# EAGLE board DashCam Schematic (EAGLE 8.0.2)
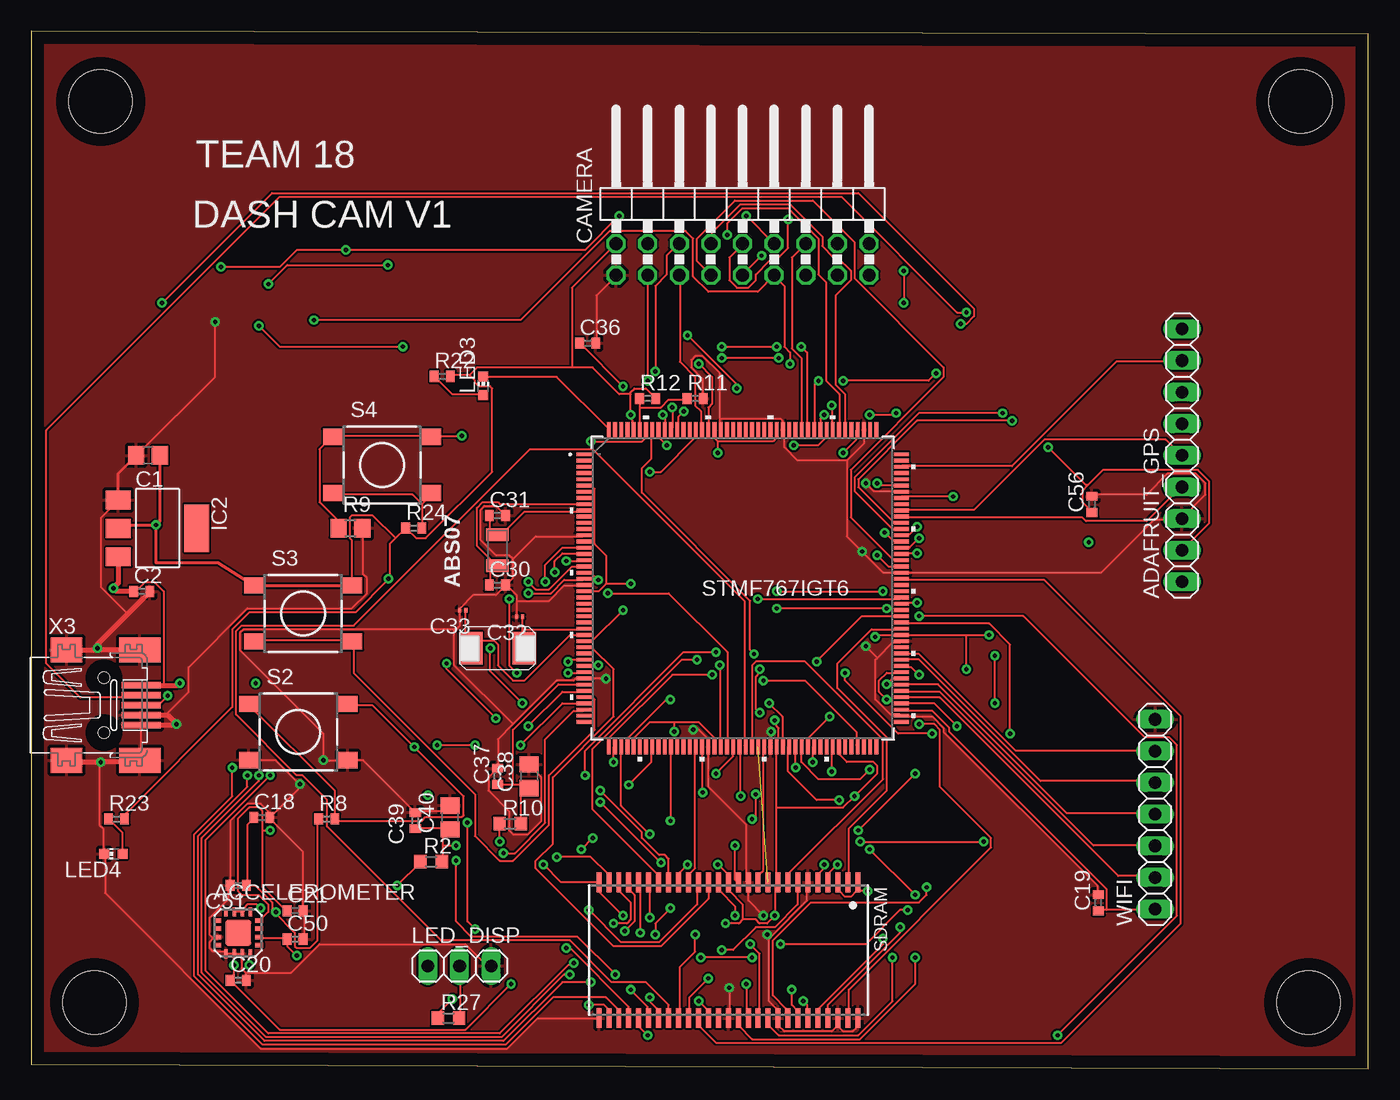
[diagram p2: board, top side]
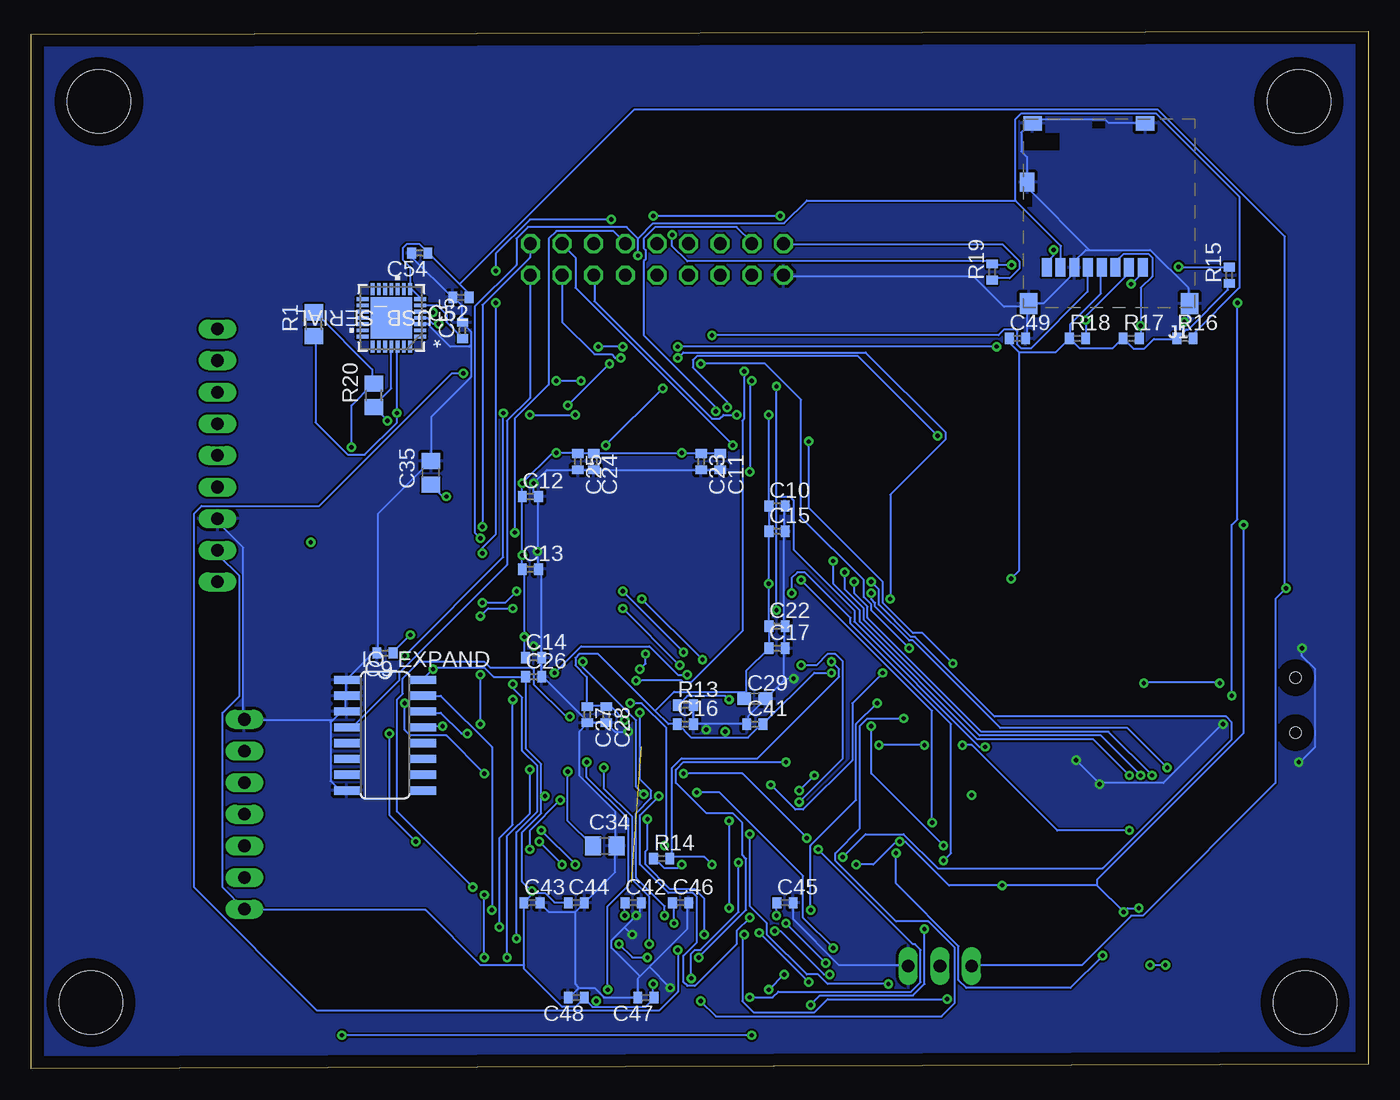
[diagram p3: board, bottom side, seen from below]

Size 107.42 x 83.36 mm. Coordinates in mm from the lower left corner, seen from the top.
Outline: 0,0.38 107.42,0 107.42,83.11 0,83.36 0,0.38
Copper layers (1*16): Top 0.035mm / dielectric 1.5mm / Bottom 0.035mm
Design rules "default": minimum track width 6mil, minimum drill 0.35mm, track to track 6mil, track to pad 6mil, pad to pad 6mil, via to via 6mil, smd to smd 6mil, copper to edge 40mil, drill to drill 6mil, minimum pad ring 10mil, minimum via ring 8mil, stop-mask expansion 4mil, vias tented up to drill 0mil, thermal gap 10mil
Holes 5.08 mm at 5.59,77.72 5.08,5.33 101.98,77.72 102.62,5.33

## Footprints (pad centres in the part's own frame; a part is rotated, then mirrored left to right if it is on the bottom)
6X3.3MM = smd 1.9 x 2.6: 1 -2.15,0; 2 2.15,0
2-SMD_ABM7 = smd 1 x 1.8: P$1 -1.25,0; P$2 1.25,0
LFCSP16 = smd 0.7 x 0.35: 1 -1.675,0.975; 2 -1.675,0.325; 3 -1.675,-0.325; 4 -1.675,-0.975; 9 1.675,-0.975; 10 1.675,-0.325; 11 1.675,0.325; 12 1.675,0.975 | smd 0.35 x 0.7: 5 -0.975,-1.675; 6 -0.325,-1.675; 7 0.325,-1.675; 8 0.975,-1.675; 13 0.975,1.675; 14 0.325,1.675; 15 -0.325,1.675; 16 -0.975,1.675 | smd 2.1 x 2.1: EXP 0,0
1X09 = drill 1.016 long: 1 -10.16,0; 2 -7.62,0; 3 -5.08,0; 4 -2.54,0; 5 0,0; 6 2.54,0; 7 5.08,0; 8 7.62,0; 9 10.16,0
C0805 = smd 1.3 x 1.5: 1 -0.95,0; 2 0.95,0
C0402 = smd 0.7 x 0.9: 1 -0.65,0; 2 0.65,0
C0603 = smd 1.1 x 1: 1 -0.85,0; 2 0.85,0
C0201 = smd 0.25 x 0.35: 1 -0.25,0; 2 0.25,0
2X09/90 = drill 1.016 octagon: 1 -10.16,-6.35; 2 -10.16,-3.81; 3 -7.62,-6.35; 4 -7.62,-3.81; 5 -5.08,-6.35; 6 -5.08,-3.81; 7 -2.54,-6.35; 8 -2.54,-3.81; 9 0,-6.35; 10 0,-3.81; 11 2.54,-6.35; 12 2.54,-3.81; 13 5.08,-6.35; 14 5.08,-3.81; 15 7.62,-6.35; 16 7.62,-3.81; 17 10.16,-6.35; 18 10.16,-3.81
SOT223 = smd 1.499 x 2.007: 1 -2.261,-3.15; 2 0.025,-3.15; 3 2.311,-3.15 | smd 3.81 x 2.007: 4 0,3.15
SO16 = smd 0.66 x 2.032: 1 -4.445,-3.073; 2 -3.175,-3.073; 3 -1.905,-3.073; 4 -0.635,-3.073; 5 0.635,-3.073; 6 1.905,-3.073; 7 3.175,-3.073; 8 4.445,-3.073; 9 4.445,3.073; 10 3.175,3.073; 11 1.905,3.073; 12 0.635,3.073; 13 -0.635,3.073; 14 -1.905,3.073; 15 -3.175,3.073; 16 -4.445,3.073
5025700893 = smd 1.4 x 1.7: GND0 6.45,7.1; GND2 -6.45,7.1 | smd 1.5 x 1.15: GND1 6.15,-7.375; GND3 -2.9,-7.375 | smd 1.15 x 1.5: GND4 6.575,-2.65 | smd 0.8 x 1.5: P$1 -2.7,4.2; P$2 -1.6,4.2; P$3 -0.5,4.2; P$4 0.6,4.2; P$5 1.7,4.2; P$6 2.8,4.2; P$7 3.9,4.2; P$8 5,4.2
CHIP-LED0603 = smd 0.8 x 0.8: A 0,-0.75; C 0,0.75
1X03 = drill 1.016 long: 1 -2.54,0; 2 0,0; 3 2.54,0
R0805 = smd 1.3 x 1.5: 1 -0.95,0; 2 0.95,0
R0603 = smd 1 x 1.1: 1 -0.85,0; 2 0.85,0
R0402 = smd 0.7 x 0.9: 1 -0.65,0; 2 0.65,0
DTSM-6 = smd 1.55 x 1.3: 1 -3.975,2.25; 2 3.975,2.25; 3 -3.975,-2.25; 4 3.975,-2.25
TSOP54 = smd 0.4 x 1.6: 1 -10.4,-5.45; 2 -9.6,-5.45; 3 -8.8,-5.45; 4 -8,-5.45; 5 -7.2,-5.45; 6 -6.4,-5.45; 7 -5.6,-5.45; 8 -4.8,-5.45; 9 -4,-5.45; 10 -3.2,-5.45; 11 -2.4,-5.45; 12 -1.6,-5.45; 13 -0.8,-5.45; 14 0,-5.45; 15 0.8,-5.45; 16 1.6,-5.45; 17 2.4,-5.45; 18 3.2,-5.45; 19 4,-5.45; 20 4.8,-5.45; 21 5.6,-5.45; 22 6.4,-5.45; 23 7.2,-5.45; 24 8,-5.45; 25 8.8,-5.45; 26 9.6,-5.45; 27 10.4,-5.45; 28 10.4,5.45; 29 9.6,5.45; 30 8.8,5.45; 31 8,5.45; 32 7.2,5.45; 33 6.4,5.45; 34 5.6,5.45; 35 4.8,5.45; 36 4,5.45; 37 3.2,5.45; 38 2.4,5.45; 39 1.6,5.45; 40 0.8,5.45; 41 0,5.45; 42 -0.8,5.45; 43 -1.6,5.45; 44 -2.4,5.45; 45 -3.2,5.45; 46 -4,5.45; 47 -4.8,5.45; 48 -5.6,5.45; 49 -6.4,5.45; 50 -7.2,5.45; 51 -8,5.45; 52 -8.8,5.45; 53 -9.6,5.45; 54 -10.4,5.45
LQFP-176_24X24 = smd 1.2 x 0.3: 1 -12.75,10.75; 2 -12.75,10.25; 3 -12.75,9.75; 4 -12.75,9.25; 5 -12.75,8.75; 6 -12.75,8.25; 7 -12.75,7.75; 8 -12.75,7.25; 9 -12.75,6.75; 10 -12.75,6.25; 11 -12.75,5.75; 12 -12.75,5.25; 13 -12.75,4.75; 14 -12.75,4.25; 15 -12.75,3.75; 16 -12.75,3.25; 17 -12.75,2.75; 18 -12.75,2.25; 19 -12.75,1.75; 20 -12.75,1.25; 21 -12.75,0.75; 22 -12.75,0.25; 23 -12.75,-0.25; 24 -12.75,-0.75; 25 -12.75,-1.25; 26 -12.75,-1.75; 27 -12.75,-2.25; 28 -12.75,-2.75; 29 -12.75,-3.25; 30 -12.75,-3.75; 31 -12.75,-4.25; 32 -12.75,-4.75; 33 -12.75,-5.25; 34 -12.75,-5.75; 35 -12.75,-6.25; 36 -12.75,-6.75; 37 -12.75,-7.25; 38 -12.75,-7.75; 39 -12.75,-8.25; 40 -12.75,-8.75; 41 -12.75,-9.25; 42 -12.75,-9.75; 43 -12.75,-10.25; 44 -12.75,-10.75; 89 12.75,-10.75; 90 12.75,-10.25; 91 12.75,-9.75; 92 12.75,-9.25; 93 12.75,-8.75; 94 12.75,-8.25; 95 12.75,-7.75; 96 12.75,-7.25; 97 12.75,-6.75; 98 12.75,-6.25; 99 12.75,-5.75; 100 12.75,-5.25; 101 12.75,-4.75; 102 12.75,-4.25; 103 12.75,-3.75; 104 12.75,-3.25; 105 12.75,-2.75; 106 12.75,-2.25; 107 12.75,-1.75; 108 12.75,-1.25; 109 12.75,-0.75; 110 12.75,-0.25; 111 12.75,0.25; 112 12.75,0.75; 113 12.75,1.25; 114 12.75,1.75; 115 12.75,2.25; 116 12.75,2.75; 117 12.75,3.25; 118 12.75,3.75; 119 12.75,4.25; 120 12.75,4.75; 121 12.75,5.25; 122 12.75,5.75; 123 12.75,6.25; 124 12.75,6.75; 125 12.75,7.25; 126 12.75,7.75; 127 12.75,8.25; 128 12.75,8.75; 129 12.75,9.25; 130 12.75,9.75; 131 12.75,10.25; 132 12.75,10.75 | smd 0.3 x 1.2: 45 -10.75,-12.75; 46 -10.25,-12.75; 47 -9.75,-12.75; 48 -9.25,-12.75; 49 -8.75,-12.75; 50 -8.25,-12.75; 51 -7.75,-12.75; 52 -7.25,-12.75; 53 -6.75,-12.75; 54 -6.25,-12.75; 55 -5.75,-12.75; 56 -5.25,-12.75; 57 -4.75,-12.75; 58 -4.25,-12.75; 59 -3.75,-12.75; 60 -3.25,-12.75; 61 -2.75,-12.75; 62 -2.25,-12.75; 63 -1.75,-12.75; 64 -1.25,-12.75; 65 -0.75,-12.75; 66 -0.25,-12.75; 67 0.25,-12.75; 68 0.75,-12.75; 69 1.25,-12.75; 70 1.75,-12.75; 71 2.25,-12.75; 72 2.75,-12.75; 73 3.25,-12.75; 74 3.75,-12.75; 75 4.25,-12.75; 76 4.75,-12.75; 77 5.25,-12.75; 78 5.75,-12.75; 79 6.25,-12.75; 80 6.75,-12.75; 81 7.25,-12.75; 82 7.75,-12.75; 83 8.25,-12.75; 84 8.75,-12.75; 85 9.25,-12.75; 86 9.75,-12.75; 87 10.25,-12.75; 88 10.75,-12.75; 133 10.75,12.75; 134 10.25,12.75; 135 9.75,12.75; 136 9.25,12.75; 137 8.75,12.75; 138 8.25,12.75; 139 7.75,12.75; 140 7.25,12.75; 141 6.75,12.75; 142 6.25,12.75; 143 5.75,12.75; 144 5.25,12.75; 145 4.75,12.75; 146 4.25,12.75; 147 3.75,12.75; 148 3.25,12.75; 149 2.75,12.75; 150 2.25,12.75; 151 1.75,12.75; 152 1.25,12.75; 153 0.75,12.75; 154 0.25,12.75; 155 -0.25,12.75; 156 -0.75,12.75; 157 -1.25,12.75; 158 -1.75,12.75; 159 -2.25,12.75; 160 -2.75,12.75; 161 -3.25,12.75; 162 -3.75,12.75; 163 -4.25,12.75; 164 -4.75,12.75; 165 -5.25,12.75; 166 -5.75,12.75; 167 -6.25,12.75; 168 -6.75,12.75; 169 -7.25,12.75; 170 -7.75,12.75; 171 -8.25,12.75; 172 -8.75,12.75; 173 -9.25,12.75; 174 -9.75,12.75; 175 -10.25,12.75; 176 -10.75,12.75
QFN28N5X5-0P5P = smd 0.965 x 0.305: 1 -2.324,1.5; 2 -2.324,1; 3 -2.324,0.5; 4 -2.324,0; 5 -2.324,-0.5; 6 -2.324,-1; 7 -2.324,-1.5; 15 2.324,-1.5; 16 2.324,-1; 17 2.324,-0.5; 18 2.324,0; 19 2.324,0.5; 20 2.324,1; 21 2.324,1.5 | smd 0.305 x 0.965: 8 -1.5,-2.324; 9 -1,-2.324; 10 -0.5,-2.324; 11 0,-2.324; 12 0.5,-2.324; 13 1,-2.324; 14 1.5,-2.324; 22 1.5,2.324; 23 1,2.324; 24 0.5,2.324; 25 0,2.324; 26 -0.5,2.324; 27 -1,2.324; 28 -1.5,2.324 | smd 3.353 x 3.353: 29 0,0
1X07 = drill 1.016 long: 1 -7.62,0; 2 -5.08,0; 3 -2.54,0; 4 0,0; 5 2.54,0; 6 5.08,0; 7 7.62,0
32005-201 = smd 3.1 x 0.5: 1 3,1.6; 2 3,0.8; 3 3,0; 4 3,-0.8; 5 3,-1.6 | smd 2.5 x 2: M1 -3,-4.45; M2 -3,4.45 | smd 3.3 x 2: M3 2.9,4.45; M4 2.9,-4.45 | hole 0.9: 0,2.2; 0,-2.2

## Placement (x,y rotation side)
ABM3  CRYSTAL25MHZ  [6X3.3MM]  37.47,33.78 180 top
ABS07  CRYSTAL32KHZ  [2-SMD_ABM7]  37.47,41.66 90 top
ACCELEROMETER  ADXL335  [LFCSP16]  16.64,10.92 0 top
ADAFRUIT_GPS  746  [1X09]  92.46,49.28 90 top
C1  10uF  [C0805]  9.4,49.28 180 top
C2  0.1uF  [C0402]  8.89,38.35 0 top
C9  0.1uF  [C0402]  78.99,33.4 180 bottom
C10  0.1uF  [C0402]  47.5,45.21 0 bottom
C11  0.1uF  [C0402]  52.07,48.77 270 bottom
C12  0.1uF  [C0402]  67.31,45.97 0 bottom
C13  0.1uF  [C0402]  67.31,40.13 0 bottom
C14  0.1uF  [C0402]  67.06,33.02 0 bottom
C15  0.1uF  [C0402]  47.5,43.18 0 bottom
C16  0.1uF  [C0402]  54.86,27.69 0 bottom
C17  0.1uF  [C0402]  47.5,33.78 0 bottom
C18  0.1uF  [C0402]  18.54,20.19 0 top
C19  0.1uF  [C0402]  85.72,13.33 90 top
C20  0.1uF  [C0402]  16.64,7.11 0 top
C21  0.1uF  [C0402]  21.21,12.7 0 top
C22  0.1uF  [C0402]  47.5,35.56 0 bottom
C23  0.1uF  [C0402]  53.59,48.77 270 bottom
C24  0.1uF  [C0402]  62.23,48.77 270 bottom
C25  0.1uF  [C0402]  63.5,48.77 270 bottom
C26  0.1uF  [C0402]  67.06,31.5 0 bottom
C27  0.1uF  [C0402]  62.74,28.45 270 bottom
C28  0.1uF  [C0402]  61.21,28.45 270 bottom
C29  4.7uF  [C0603]  49.28,29.72 0 bottom
C30  6pF  [C0402]  37.47,38.86 0 top
C31  6pF  [C0402]  37.47,44.45 0 top
C32  22pF  [C0201]  39.24,36.32 180 top
C33  22pF  [C0201]  34.67,36.83 180 top
C34  2.2uF  [C0805]  61.34,17.91 0 bottom
C35  2.2uF  [C0805]  75.31,47.88 90 bottom
C36  0.1uF  [C0402]  44.7,58.29 0 top
C37  0.1uF  [C0402]  37.47,23.5 90 top
C38  2.2uF  [C0805]  40.01,23.5 90 top
C39  0.1uF  [C0402]  30.86,19.94 90 top
C40  2.2uF  [C0805]  33.66,20.19 90 top
C41  0.1uF  [C0402]  49.28,27.69 0 bottom
C42  0.1uF  [C0402]  59.05,13.33 0 bottom
C43  0.1uF  [C0402]  67.18,13.33 0 bottom
C44  0.1uF  [C0402]  63.63,13.33 0 bottom
C45  0.1uF  [C0402]  46.86,13.33 0 bottom
C46  0.1uF  [C0402]  55.24,13.33 0 bottom
C47  0.1uF  [C0402]  58.04,5.71 180 bottom
C48  0.1uF  [C0402]  63.63,5.71 180 bottom
C49  0.1uF  [C0402]  28.19,58.67 0 bottom
C50  0.1uF  [C0402]  21.21,10.41 0 top
C51  0.1uF  [C0402]  16.64,14.73 180 top
C52  0.1uF  [C0402]  72.9,61.98 180 bottom
C54  1.0uF  [C0402]  76.2,65.53 180 bottom
C55  0.1uF  [C0402]  72.77,59.31 90 bottom
C56  0.1uF  [C0402]  85.22,45.34 90 top
CAMERA  OV2640  [2X09/90]  57.15,70.1 0 top
IC2  REG1117  [SOT223]  10.16,43.43 270 top
IO_EXPAND  PCF8574AT  [SO16]  78.99,26.8 270 bottom
J1  MICROSD_MOLEX_5025700893  [5025700893]  20.83,68.58 180 bottom
LED3  [CHIP-LED0603]  36.32,54.86 0 top
LED4  [CHIP-LED0603]  6.6,17.27 90 top
LED_DISP  NEOPIXEL  [1X03]  34.42,8.25 0 top
R1  100K  [R0805]  84.71,59.82 90 bottom
R2  10R  [R0603]  32.13,16.64 0 top
R8  10K  [R0402]  23.75,20.07 0 top
R9  100K  [R0805]  25.65,43.43 0 top
R10  10R  [R0603]  38.48,19.69 0 top
R11  0R  [R0402]  53.34,53.85 0 top
R12  0R  [R0402]  49.53,53.85 0 top
R13  10K  [R0402]  54.86,29.21 0 bottom
R14  10K  [R0402]  56.77,16.89 0 bottom
R15  47K  [R0402]  11.18,63.75 90 bottom
R16  47K  [R0402]  14.73,58.67 0 bottom
R17  47K  [R0402]  19.05,58.67 0 bottom
R18  47K  [R0402]  23.37,58.67 0 bottom
R19  47K  [R0402]  30.23,64.01 90 bottom
R20  100K  [R0805]  79.88,54.1 90 bottom
R22  100R  [R0402]  33.02,55.63 0 top
R23  100R  [R0402]  6.86,20.07 0 top
R24  47K  [R0402]  30.73,43.43 0 top
R27  470R  [R0603]  33.53,4.06 0 top
S2  DTSM-6  [DTSM-6]  21.46,27.05 0 top
S3  DTSM-6  [DTSM-6]  21.84,36.58 0 top
S4  DTSM-6  [DTSM-6]  28.19,48.51 0 top
SDRAM  W9825G6KH  [TSOP54]  56.01,9.53 180 top
STMF767IGT6  STM32F76XIXT  [LQFP-176_24X24]  57.15,38.61 0 top
USB_SERIAL  CP2102  [QFN28N5X5-0P5P]  78.49,60.32 180 bottom
WIFI  ESP8266  [1X07]  90.3,20.45 90 top
X3  MINI-USB-SCHIELD-32005-201  [32005-201]  5.84,29.21 0 top

## Tracks (layer width: path | path; a pad name or v marks a point on that pad's centre or on a via)
5V  (via drill 0.35)
  Top 0.152: 10.67,30.81 10.67,38.35 9.91,39.12 9.14,39.12 8.38,38.35 C2.1
  Top 0.406: X3.1 10.67,30.81 11.76,30.81 v11.94,30.99 | IC2.3 7.01,39.01 v6.6,38.61 6.86,38.35 C2.1
  Bottom 0.152: 76.96,62.74 76.2,61.98 USB_SERIAL.7 | 73,63.04 75.44,65.48 C54.1 75.59,65.63 76.2,66.24 77.27,66.24 77.57,65.94 77.57,65.02 76.96,64.41 76.96,62.74 | 73,63.04 72.39,62.43 72.39,61.98 C52.1 | 76.96,62.74 USB_SERIAL.8 | v18.03,30.99 17.98,31.04 12.04,31.04 v11.94,30.99 | LED_DISP.1 31.85,8.33 23.01,8.33 19.05,12.29 18.14,12.29 7.47,22.96 7.47,37.74 v6.6,38.61 6.71,38.66 6.71,66.85 16.92,77.06 58.98,77.06 73,63.04
ADC1_IN1  (via drill 0.35)
  Top 0.152: 18.59,19.15 18.59,14.58 20.42,12.75 C21.1 | 18.59,19.15 18.59,20.68 18.29,20.98 17.53,20.98 16.61,20.07 16.61,14.28 16.92,13.97 18.29,13.97 19.05,13.21 19.05,12.6 18.44,11.99 ACCELEROMETER.12 | v39.32,26.01 42.67,29.36 44.35,29.36 STMF767IGT6.41 | v32.61,26.01 v35.66,26.01 | 18.59,19.15 v19.2,19.15
  Bottom 0.152: v35.66,26.01 v39.32,26.01 | v32.61,26.01 31.85,26.01 24.99,19.15 v19.2,19.15
ADC1_IN2  (via drill 0.35)
  Top 0.152: ACCELEROMETER.10 18.44,10.46 20.42,10.46 C50.1 20.57,10.31 20.57,9.86 v21.34,9.09 | v37.95,17.32 38.86,17.32 41.3,19.76 41.3,26.47 43.59,28.75 44.35,28.75 STMF767IGT6.42
  Bottom 0.152: v37.95,17.32 37.95,14.88 32.92,9.86 32.92,7.11 32.31,6.5 23.93,6.5 v21.34,9.09
ADC1_IN3  (via drill 0.35)
  Top 0.152: v17.53,8.33 17.53,9.25 ACCELEROMETER.8 | v16.31,8.33 16.31,7.42 16,7.11 | v49.68,18.85 47.4,21.13 STMF767IGT6.47 | v38.56,6.81 34.9,3.15 19.96,3.15 16,7.11 | 16,7.11 C20.1
  Bottom 0.152: v16.31,8.33 v17.53,8.33 | v49.68,18.85 49.68,13.06 48.31,11.68 48.31,10.77 45.11,7.57 44.2,7.57 43.43,6.81 v38.56,6.81
D+  (via drill 0.35)
  Top 0.152: v74.68,59.84 75.13,59.84 75.74,60.45 75.74,61.06 66.45,70.36 19.36,70.36 v10.52,61.52 | v10.97,29.97 10.21,29.21 X3.3
  Bottom 0.152: v74.68,59.84 75.13,59.84 75.59,60.3 76.05,60.3 USB_SERIAL.4 | v10.52,61.52 10.52,44.14 10.97,43.69 v10.97,29.97
D-  (via drill 0.35)
  Top 0.152: v75.13,60.76 74.37,60.76 65.08,70.05 19.96,70.05 1.22,51.31 1.22,32.56 3.96,29.82 8.69,29.82 8.84,29.97 X3.2
  Bottom 0.152: v75.13,60.76 76.05,60.76 USB_SERIAL.5
DCMI_D0
  Top 0.152: CAMERA.7 53.49,64.87 53.49,66.7 56.54,69.75 62.79,69.75 66.14,66.4 66.14,63.5 73.3,56.34 73.3,55.57 65.84,48.11 65.84,44.3 69.19,40.95 69.8,40.95 STMF767IGT6.115
DCMI_D1  (via drill 0.35)
  Top 0.152: v71.17,41.4 69.95,41.4 STMF767IGT6.116 | v70.1,64.11 v70.1,61.52 | v60.81,68.22 60.81,65.94 59.74,64.87 59.28,64.87 58.22,63.8 58.22,63.35 57.61,62.74 56.69,62.74 56.08,63.35 56.08,65.18 57.15,66.24 CAMERA.10
  Bottom 0.152: v71.17,41.4 71.17,41.86 70.1,42.93 v70.1,61.52 | v70.1,64.11 70.1,65.48 67.36,68.22 v60.81,68.22
DCMI_D5
  Top 0.152: CAMERA.14 61.11,65.18 61.11,57.86 61.87,57.1 61.87,51.46 STMF767IGT6.145
DCMI_D6  (via drill 0.35)
  Top 0.152: v50.75,52.53 50.9,52.38 50.9,51.46 STMF767IGT6.167
  Bottom 0.152: v50.75,52.53 51.82,52.53 52.12,52.22 52.73,52.22 62.18,61.67 62.18,63.65 CAMERA.13
DCMI_D7  (via drill 0.35)
  Top 0.152: v51.05,50.09 50.44,50.7 50.44,51.31 STMF767IGT6.168
  Bottom 0.152: v51.05,50.09 63.7,62.74 63.7,65.18 64.77,66.24 CAMERA.16
DCMI_HREF  (via drill 0.35)
  Top 0.152: v58.83,31.19 62.18,31.19 66.29,27.08 66.29,26.01 STMF767IGT6.85 | v50.14,56.03 50.14,62.89 51.05,63.8 51.05,65.33 51.97,66.24 CAMERA.6
  Bottom 0.152: v58.83,31.19 55.17,31.19 55.02,31.04 54.41,31.04 50.29,35.15 50.29,52.07 50.14,52.22 v50.14,56.03
DCMI_PCLK  (via drill 0.35)
  Top 0.152: v48.01,22.81 49.84,24.64 49.84,25.86 STMF767IGT6.52 | v39.01,31.8 38.41,32.41 v38.41,37.74 | v60.05,57.1 v55.47,57.1
  Bottom 0.152: v48.01,22.81 46.02,20.83 45.41,20.83 41.45,24.79 41.45,29.36 v39.01,31.8 | v38.41,37.74 38.41,46.13 33.98,50.55 33.98,51.16 40.39,57.56 55.02,57.56 v55.47,57.1 | v60.05,57.1 60.5,57.1 60.81,57.4 62.18,57.4 64.77,59.99 CAMERA.15
DCMI_PWDN
  Bottom 0.152: IO_EXPAND.4 81.99,27.53 81.53,27.53 77.88,31.19 77.88,31.8 69.19,40.49 69.19,52.07 67.36,53.9 67.36,63.65 CAMERA.17
DCMI_RESET
  Top 0.152: STMF767IGT6.138 65.38,51.46 65.38,54.2 64.62,54.97 64.62,62.13 65.84,63.35 65.84,64.11 64.77,65.18 64.47,65.18 63.55,66.09 63.55,66.85 60.96,69.44 57,69.44 54.71,67.16 54.71,66.4 CAMERA.8
DCMI_SCL  (via drill 0.35)
  Top 0.152: v49.68,47.95 50.6,47.95 53.34,50.7 53.34,51.31 STMF767IGT6.162 | CAMERA.3 v49.53,55.27
  Bottom 0.152: v49.68,47.95 49.68,55.12 v49.53,55.27
DCMI_SDA
  Top 0.152: STMF767IGT6.161 53.8,51.46 53.8,52.83 53.34,53.29 53.34,55.57 52.12,56.79 52.12,63.65 CAMERA.5
DCMI_VSYNC  (via drill 0.35)
  Top 0.152: v52.43,52.83 51.97,52.38 51.97,51.46 STMF767IGT6.165
  Bottom 0.152: v52.43,52.83 52.43,53.14 58.22,58.93 58.22,64.87 58.06,65.02 58.06,65.79 58.22,65.94 58.22,66.7 57.3,67.62 50.75,67.62 49.53,66.4 CAMERA.4
DCMI_XCLK  (via drill 0.35)
  Top 0.152: v71.17,43.54 70.56,42.93 69.95,42.93 STMF767IGT6.119
  Bottom 0.152: v71.17,43.54 71.17,61.37 67.36,65.18 67.36,66.24 CAMERA.18
FMC_A0  (via drill 0.35)
  Top 0.152: v41.3,39.12 41.3,40.49 42.67,41.86 44.35,41.86 STMF767IGT6.16 | v17.37,23.57 17.37,22.66 13.41,18.69 13.41,7.57 18.75,2.24 37.95,2.24 42.67,6.96 v44.96,6.96 | v48.92,10.92 48.92,14.88 SDRAM.23
  Bottom 0.152: v41.3,39.12 41.3,38.2 40.23,37.13 40.23,36.22 31.09,27.08 20.88,27.08 v17.37,23.57 | v48.92,10.92 v44.96,6.96
FMC_A1  (via drill 0.35)
  Top 0.152: v42.06,39.88 42.06,40.79 42.67,41.4 44.35,41.4 STMF767IGT6.17 | v18.29,23.57 18.29,23.11 13.72,18.54 13.72,7.72 18.9,2.54 37.8,2.54 42.82,7.57 v43.28,7.57 | v47.7,11.07 48.46,11.84 48.46,13.97 48.16,14.28 48.16,14.88 SDRAM.24
  Bottom 0.152: v42.06,39.88 42.06,38.51 40.54,36.98 40.54,36.07 31.24,26.77 21.49,26.77 v18.29,23.57 | v43.28,7.57 43.74,7.57 47.24,11.07 v47.7,11.07
FMC_A2  (via drill 0.35)
  Top 0.152: v42.98,40.79 44.35,40.79 STMF767IGT6.18 | v19.2,23.57 14.02,18.39 14.02,7.87 19.05,2.85 37.64,2.85 43.28,8.48 v43.59,8.48 | v46.79,11.68 47.85,11.68 48.16,11.99 48.16,13.36 47.24,14.28 47.24,14.88 SDRAM.25
  Bottom 0.152: v42.98,40.79 42.98,38.96 40.84,36.83 40.84,35.92 31.39,26.47 22.1,26.47 v19.2,23.57 | v46.79,11.68 v43.59,8.48
FMC_A3  (via drill 0.35)
  Top 0.152: v39.93,39.12 40.54,38.51 41.6,38.51 43.43,40.34 44.35,40.34 STMF767IGT6.19 | v42.22,17.02 44.96,17.02 46.33,15.65 46.33,15.04 SDRAM.26
  Bottom 0.152: v39.93,39.12 39.32,38.51 39.32,37.29 36.73,34.7 36.42,34.7 30.02,28.3 11.43,28.3 10.97,27.84 10.97,26.47 21.34,16.1 34.59,16.1 37.34,18.85 40.39,18.85 v42.22,17.02
FMC_A4  (via drill 0.35)
  Top 0.152: v45.57,39.27 44.96,39.88 44.5,39.88 STMF767IGT6.20 | v35.05,19.76 35.05,11.84 v35.66,11.23 | v44.81,5.13 46.02,5.13 46.33,4.83 46.33,4.22 SDRAM.29
  Bottom 0.152: v45.57,39.27 35.05,28.75 v35.05,19.76 | v35.66,11.23 35.66,6.81 36.58,5.89 44.04,5.89 v44.81,5.13
FMC_A5  (via drill 0.35)
  Top 0.152: v39.93,38.2 41.76,38.2 42.82,39.27 44.35,39.27 STMF767IGT6.21 | v16.15,24.18 16.15,21.89 13.11,18.85 13.11,7.42 18.59,1.93 38.1,1.93 41.91,5.74 46.18,5.74 47.09,4.83 47.09,4.22 SDRAM.30
  Bottom 0.152: v39.93,38.2 39.93,37.74 39.62,37.44 39.62,37.13 36.88,34.39 36.58,34.39 29.57,27.38 19.36,27.38 v16.15,24.18
FMC_A6  (via drill 0.35)
  Top 0.152: v53.95,22.2 53.95,25.86 STMF767IGT6.60 | v42.98,9.7 43.28,9.7 48.01,4.98 48.01,4.22 SDRAM.31
  Bottom 0.152: v53.95,22.2 52.12,22.2 45.41,15.49 45.41,12.14 v42.98,9.7
FMC_A7  (via drill 0.35)
  Top 0.152: v55.32,32.41 55.32,26.01 STMF767IGT6.63 | v68.73,36.98 v59.89,36.98 | v71.32,36.37 79.7,36.37 89.46,26.62 91.44,26.62 92.05,26.01 92.05,12.29 v82.45,2.69 | v49.53,2.69 48.92,3.3 48.92,4.06 SDRAM.32
  Bottom 0.152: v59.89,36.98 v55.32,32.41 | v68.73,36.98 70.71,36.98 v71.32,36.37 | v49.53,2.69 v82.45,2.69
FMC_A8  (via drill 0.35)
  Top 0.152: v46.33,38.2 51.21,38.2 55.93,33.48 55.93,26.01 STMF767IGT6.64 | v34.14,16.71 34.14,11.84 35.36,10.62 43.89,10.62 v46.94,7.57 | v48.16,6.35 49.53,4.98 49.53,4.22 SDRAM.33
  Bottom 0.152: v46.33,38.2 46.33,39.42 45.87,39.88 45.26,39.88 41.6,36.22 41.6,35.76 33.53,27.69 33.53,17.32 v34.14,16.71 | v48.16,6.35 v46.94,7.57
FMC_A9  (via drill 0.35)
  Top 0.152: v55.02,23.72 56.39,25.1 56.39,25.86 STMF767IGT6.65 | v44.2,17.63 v45.11,18.54 | v49.68,5.74 49.68,5.44 50.29,4.83 50.29,4.22 SDRAM.34
  Bottom 0.152: v55.02,23.72 50.29,23.72 v45.11,18.54 | v44.2,17.63 36.58,10.01 36.42,10.01 35.97,9.55 35.97,6.96 36.73,6.2 47.4,6.2 47.85,5.74 v49.68,5.74
FMC_A10  (via drill 0.35)
  Top 0.152: v57,21.89 57,25.86 STMF767IGT6.66 | v49.68,12.14 49.68,14.88 SDRAM.22
  Bottom 0.152: v57,21.89 58.52,20.37 58.52,16.41 56.24,14.12 54.25,14.12 53.95,13.82 53.95,10.16 55.02,9.09 55.02,6.96 54.71,6.65 54.1,6.65 50.75,10.01 50.75,11.07 v49.68,12.14
FMC_A11
  Top 0.152: STMF767IGT6.67 57.3,26.01 57.3,37.59 45.11,49.78 40.08,49.78 25.91,35.61 16.92,35.61 16.46,35.15 16.46,28.45 21.34,23.57 21.79,23.57 23.77,21.59 23.77,19.46 32.92,10.31 43.28,10.31 46.63,6.96 49.38,6.96 51.21,5.13 51.21,4.22 SDRAM.35
FMC_A12  (via drill 0.35)
  Top 0.152: v63.09,32.71 66.75,36.37 69.8,36.37 STMF767IGT6.106 | v58.22,22.05 58.22,20.37 v57.91,20.07 | v53.34,10.77 53.34,9.4 52.12,8.18 52.12,4.22 SDRAM.36
  Bottom 0.152: v63.09,32.71 63.09,32.26 58.83,27.99 58.83,22.66 v58.22,22.05 | v57.91,20.07 57.91,17.63 58.06,17.48 58.06,16.41 56.08,14.43 54.1,14.43 53.34,13.66 v53.34,10.77
FMC_BA0  (via drill 0.35)
  Top 0.152: v71.17,37.44 69.95,37.44 STMF767IGT6.108 | v59.89,38.35 v68.43,38.35 | v55.02,33.48 52.43,33.48 44.5,25.55 v44.5,23.57 | v45.72,22.35 49.07,19 49.07,18.54 50.44,17.17 50.9,17.17 51.21,16.87 51.21,15.04 SDRAM.20
  Bottom 0.152: v71.17,37.44 69.34,37.44 v68.43,38.35 | v55.02,33.48 v59.89,38.35 | v45.72,22.35 v44.5,23.57
FMC_BA1  (via drill 0.35)
  Top 0.152: v58.37,37.74 69.8,37.74 STMF767IGT6.109 | v53.49,32.87 52.27,32.87 45.11,25.71 45.11,20.83 50.29,15.65 50.29,15.04 SDRAM.21
  Bottom 0.152: v53.49,32.87 v58.37,37.74
FMC_D0
  Top 0.152: STMF767IGT6.104 69.8,35.31 67.51,35.31 64.77,32.56 64.77,30.58 68.73,26.62 68.73,22.35 65.68,19.3 65.68,15.04 SDRAM.2
FMC_D1  (via drill 0.35)
  Top 0.152: v78.64,26.92 78.64,34.09 76.96,35.76 69.95,35.76 STMF767IGT6.105 | v66.6,18.24 v76.5,18.24 | v64.77,16.41 64.01,15.65 64.01,15.04 SDRAM.4
  Bottom 0.152: v78.64,26.92 78.64,20.37 v76.5,18.24 | v64.77,16.41 v66.6,18.24
FMC_D2  (via drill 0.35)
  Top 0.152: v63.7,52.53 63.4,52.22 63.4,51.46 STMF767IGT6.142 | v67.36,52.53 69.34,52.53 v69.49,52.68 | v77.42,29.36 v77.42,33.17 | v66.45,19.15 v71.02,23.72 | v63.7,16.41 63.7,16.1 63.25,15.65 63.25,15.04 SDRAM.5
  Bottom 0.152: v67.36,52.53 v63.7,52.53 | v69.49,52.68 69.49,41.1 v77.42,33.17 | v77.42,29.36 77.42,27.23 76.96,26.77 74.07,26.77 v71.02,23.72 | v63.7,16.41 v66.45,19.15
FMC_D3  (via drill 0.35)
  Top 0.152: v63.25,55.27 62.94,54.97 62.94,51.46 STMF767IGT6.143 | v65.23,55.27 72.08,55.27 v72.69,55.88 | v55.47,9.55 56.39,9.55 58.22,11.38 59.74,11.38 61.57,13.21 61.57,14.88 SDRAM.7
  Bottom 0.152: v65.23,55.27 v63.25,55.27 | v72.69,55.88 73.61,55.88 84.28,45.21 93.73,45.21 94.34,44.6 94.34,14.58 84.43,4.67 57,4.67 55.47,6.2 v55.47,9.55
FMC_D4
  Top 0.152: STMF767IGT6.68 57.91,26.01 57.91,32.41 58.22,32.71 62.18,32.71 68.43,26.47 68.43,23.27 60.81,15.65 60.81,15.04 SDRAM.8
FMC_D5  (1 unrouted)
FMC_D6
  Top 0.152: STMF767IGT6.70 58.83,25.86 58.83,15.95 58.52,15.65 58.52,15.04 SDRAM.11
FMC_D7  (via drill 0.35)
  Top 0.152: v59.28,29.36 60.35,28.3 60.35,26.01 STMF767IGT6.73 | v56.54,17.93 56.54,15.19 56.69,15.04 SDRAM.13
  Bottom 0.152: v59.28,29.36 58.37,29.36 56.39,27.38 56.39,18.09 v56.54,17.93
FMC_D8  (via drill 0.35)
  Top 0.152: v64.92,21.59 63.09,21.59 60.81,23.88 60.81,25.86 STMF767IGT6.74 | v71.02,13.97 v67.36,17.63 | v71.02,8.94 71.02,6.81 66.6,2.39 57.91,2.39 56.84,3.45 56.84,4.06 SDRAM.42
  Bottom 0.152: v64.92,21.59 67.36,19.15 v67.36,17.63 | v71.02,8.94 v71.02,13.97
FMC_D9  (via drill 0.35)
  Top 0.152: v61.42,24.18 61.42,25.86 STMF767IGT6.75 | v57.76,10.01 58.52,9.25 58.52,4.22 SDRAM.44
  Bottom 0.152: v61.42,24.18 61.42,22.5 59.13,20.22 59.13,15.19 57.76,13.82 v57.76,10.01
FMC_D10  (via drill 0.35)
  Top 0.152: v67.36,24.03 66.6,23.27 63.25,23.27 61.87,24.64 61.87,25.86 STMF767IGT6.76 | v69.19,8.94 69.19,5.44 66.45,2.69 60.05,2.69 59.28,3.45 59.28,4.06 SDRAM.45
  Bottom 0.152: v67.36,24.03 67.36,20.52 69.19,18.69 v69.19,8.94
FMC_D11  (via drill 0.35)
  Top 0.152: v64.16,28.3 62.48,26.62 62.48,26.01 STMF767IGT6.77 | v71.93,14.58 71.93,13.97 71.32,13.36 62.64,13.36 59.59,10.31 59.59,5.89 60.66,4.83 60.66,4.22 SDRAM.47
  Bottom 0.152: v64.16,28.3 64.47,28.3 67.06,30.89 67.06,32.11 67.21,32.26 70.56,32.26 71.02,32.71 76.2,32.71 77.57,31.34 77.57,30.12 78.03,29.67 78.03,20.68 v71.93,14.58
FMC_D12  (via drill 0.35)
  Top 0.152: v62.79,24.64 62.79,25.86 STMF767IGT6.78 | v61.11,6.35 61.11,5.13 61.57,4.67 61.57,4.22 SDRAM.48
  Bottom 0.152: v62.79,24.64 62.79,23.42 59.44,20.07 59.44,14.73 61.11,13.06 v61.11,6.35
FMC_D13  (via drill 0.35)
  Top 0.152: v68.73,30.89 69.19,31.34 69.8,31.34 STMF767IGT6.96 | v68.43,10.46 68.43,10.01 63.25,4.83 63.25,4.22 SDRAM.50
  Bottom 0.152: v68.73,30.89 68.73,30.58 67.97,29.82 67.97,25.55 66.75,24.33 66.75,20.68 68.43,19 v68.43,10.46
FMC_D14  (via drill 0.35)
  Top 0.152: v68.73,29.67 68.12,30.28 68.12,31.19 68.73,31.8 69.8,31.8 STMF767IGT6.97 | v69.8,11.38 69.8,10.92 64.01,5.13 64.01,4.22 SDRAM.51
  Bottom 0.152: v68.73,29.67 68.73,19.61 69.8,18.54 v69.8,11.38
FMC_D15  (via drill 0.35)
  Top 0.152: v71.32,31.65 70.71,32.26 69.95,32.26 STMF767IGT6.98 | v71.32,27.69 72.54,27.69 73,27.23 73,22.66 77.11,18.54 77.11,17.78 65.68,6.35 65.68,4.22 SDRAM.53
  Bottom 0.152: v71.32,27.69 v71.32,31.65
FMC_NBL0  (via drill 0.35)
  Top 0.152: v58.06,33.32 57.76,33.63 57.76,37.59 49.07,46.28 49.07,48.26 49.84,49.02 49.84,51.31 STMF767IGT6.169 | v58.52,32.11 58.52,31.8 58.22,31.5 58.22,28.91 v58.52,28.6 | v56.54,12.29 56.54,13.06 55.32,14.28 55.32,14.88 SDRAM.15
  Bottom 0.152: v58.06,33.32 58.06,32.56 v58.52,32.11 | v58.52,28.6 58.52,23.27 57.61,22.35 57.61,21.74 58.83,20.52 58.83,15.34 56.54,13.06 v56.54,12.29
FMC_NBL1  (via drill 0.35)
  Top 0.152: v44.96,50.39 49.07,50.39 49.38,50.7 49.38,51.31 STMF767IGT6.170 | v33.38,32.56 33.38,32.11 v37.34,28.14 | v53.65,5.44 54.41,4.67 54.41,4.22 SDRAM.39
  Bottom 0.152: v44.96,50.39 44.96,45.06 39.01,39.12 39.01,37.44 36.58,35 35.81,35 v33.38,32.56 | v37.34,28.14 40.23,28.14 40.84,27.53 40.84,19.3 42.82,17.32 42.82,16.71 37.95,11.84 35.36,11.84 33.22,9.7 33.22,5.28 34.29,4.22 52.43,4.22 v53.65,5.44
FMC_SDCKE0  (via drill 0.35)
  Top 0.152: v45.57,32.41 44.5,32.41 STMF767IGT6.35 | v50.6,16.56 v45.72,21.44 | v54.41,7.26 52.88,5.74 52.88,4.22 SDRAM.37
  Bottom 0.152: v45.57,32.41 44.35,32.41 43.43,33.32 42.82,33.32 42.22,32.71 42.22,24.94 v45.72,21.44 | v50.6,16.56 50.6,12.6 53.65,9.55 54.1,9.55 54.41,9.25 v54.41,7.26
FMC_SDCLK
  Top 0.152: STMF767IGT6.112 69.95,39.27 81.38,39.27 92.35,28.3 92.35,11.68 82.75,2.08 55.02,2.08 53.65,3.45 53.65,4.06 SDRAM.38
FMC_SDNCAS  (via drill 0.35)
  Top 0.152: v53.65,56.64 54.71,55.57 54.71,53.44 54.41,53.14 54.41,51.46 STMF767IGT6.160 | v36.88,33.78 36.88,31.95 v39.47,29.36 | v44.81,12.75 47.4,10.16 50.44,10.16 53.49,13.21 53.49,14.88 SDRAM.17
  Bottom 0.152: v53.65,56.64 48.46,56.64 45.57,53.75 45.57,44.3 40.54,39.27 40.54,37.9 39.93,37.29 39.93,36.83 v36.88,33.78 | v39.47,29.36 41.15,27.69 41.15,21.59 44.81,17.93 v44.81,12.75
FMC_SDNE0  (via drill 0.35)
  Top 0.152: v52.73,16.41 52.12,15.8 52.12,15.04 SDRAM.19 | v43.13,32.71 43.28,32.87 44.35,32.87 STMF767IGT6.34
  Bottom 0.152: 55.93,17.02 53.34,17.02 v52.73,16.41 | 55.93,17.02 56.08,17.02 R14.2 55.93,17.02 | v43.13,32.71 42.52,32.11 42.52,31.5 49.07,24.94 55.17,24.94 55.93,24.18 55.93,17.02
FMC_SDNRAS
  Top 0.152: STMF767IGT6.59 53.34,25.86 53.34,16.1 52.88,15.65 52.88,15.04 SDRAM.18
FMC_SDNWE
  Top 0.152: STMF767IGT6.32 44.5,33.78 45.11,33.78 46.79,32.11 46.79,28.3 41.91,23.42 41.91,18.09 40.54,16.71 40.54,16.1 46.79,9.86 50.6,9.86 54.41,13.66 54.41,14.88 SDRAM.16
GND  (via drill 0.35)
  Top 0.152: C36.2 45.41,58.32 45.41,62.13 46.94,63.65 CAMERA.1 | C40.2 33.53,21.13 33.07,20.68 30.94,20.68 C39.2 30.79,20.68 26.67,24.79 25.45,24.79 S2.4 25.3,24.79 v23.47,24.79 23.47,26.92 16.76,33.63 16.76,35 17.07,35.31 34.14,35.31 | 14.63,10.46 14.94,10.46 ACCELEROMETER.3 14.63,10.46 | 14.63,10.46 14.33,10.16 14.33,9.7 14.63,9.4 15.54,9.4 ACCELEROMETER.5 15.7,9.25 ACCELEROMETER.6 16.46,9.25 16.92,9.25 | 17.22,7.72 17.22,7.11 C20.2 | 17.22,7.72 16.92,8.03 16.92,9.25 | 16.92,9.25 ACCELEROMETER.7 | 14.63,10.46 14.33,10.77 14.33,12.14 15.85,13.66 15.85,14.73 C51.2 16,14.73 16,19.91 17.37,21.29 18.44,21.29 19.36,20.37 | C50.2 21.95,10.46 21.95,12.6 C21.2 21.79,12.75 21.79,17.48 19.2,20.07 C18.2 | 19.36,20.37 19.2,20.22 C18.2 | 19.36,20.37 21.49,22.5 21.49,22.81 v21.59,22.86 19.66,24.79 17.53,24.79 S2.3 | 19.36,20.37 C18.2 | 17.22,7.72 20.88,7.72 23.16,10.01 34.9,10.01 36.58,8.33 36.88,8.33 LED_DISP.3 | R9.2 26.67,43.38 26.67,39.73 26.98,39.42 26.98,38.2 25.76,36.98 17.37,36.98 12.65,32.26 12.65,30.28 10.97,28.6 10.96,28.41 | 7.74,36.55 5.64,38.66 5.64,44.3 7.01,45.67 IC2.1 | v5.59,24.64 5.49,24.49 5.49,19.61 5.79,19.3 5.79,17.32 LED4.C 5.94,17.17 5.94,14.12 18.44,1.63 38.25,1.63 40.69,4.06 45.57,4.06 SDRAM.28 | X3.5 8.84,27.53 8.84,24.94 X3.M4 | v14.78,59.99 14.78,55.57 8.53,49.33 C1.2 | C56.2 85.34,46.13 89.61,46.13 91.29,47.8 93.57,47.8 94.34,47.04 94.34,46.13 92.51,44.3 ADAFRUIT_GPS.3 92.35,44.14 90.22,44.14 85.95,39.88 69.95,39.88 STMF767IGT6.113 69.8,39.88 68.43,39.88 v66.75,41.55 65.53,42.77 65.53,48.87 | 34.44,36.83 34.44,36.98 35.51,38.05 37.34,38.05 38.1,38.81 C30.2
  Top 0.152: 39.01,37.59 39.01,38.05 38.25,38.81 C30.2 | 39.01,37.59 39.01,36.37 C32.2 | 38.71,40.95 38.41,41.25 37.34,41.25 36.12,42.47 36.12,44.91 36.42,45.21 37.34,45.21 38.1,44.45 C31.2 | 38.71,40.95 38.71,39.42 38.25,38.96 C30.2 | 39.01,37.59 41.6,37.59 42.82,38.81 44.35,38.81 STMF767IGT6.22 | 38.71,40.95 40.54,42.77 44.35,42.77 STMF767IGT6.14 | 38.71,27.69 42.22,31.19 43.59,31.19 43.74,31.34 44.35,31.34 STMF767IGT6.37 44.5,31.34 v46.18,31.34 | 38.71,27.69 37.49,26.47 37.49,24.18 C37.2 37.34,24.03 36.73,23.42 36.73,22.35 38.41,20.68 38.41,19.15 38.71,18.85 39.93,18.85 41,19.91 41,23.42 40.08,24.33 C38.2 | 34.44,36.83 34.44,35.61 34.14,35.31 | 34.14,35.31 33.98,35.15 33.98,32.41 38.71,27.69 | 34.44,36.83 C33.2 | v53.19,27.23 53.65,27.23 54.41,26.47 54.41,26.01 STMF767IGT6.61 54.41,22.66 57.45,19.61 57.45,15.04 SDRAM.12 57.61,14.88 57.61,13.51 v58.83,12.29 | C19.2 85.65,14.12 85.65,14.73 73.3,27.08 73.3,27.38 72.39,28.3 69.95,28.3 STMF767IGT6.90 69.8,28.45 69.04,28.45 67.82,29.67 67.82,32.87 67.97,33.02 | 67.97,33.02 69.19,34.24 69.8,34.24 STMF767IGT6.102 | 55.32,52.22 55.32,51.46 STMF767IGT6.158 | 55.32,52.22 55.32,55.88 53.95,57.25 53.34,57.25 53.03,56.95 53.03,56.34 53.95,55.42 53.95,53.9 R11.2 | 55.32,52.22 60.2,52.22 60.35,52.07 60.35,51.46 STMF767IGT6.148 60.5,51.31 60.5,49.94 61.57,48.87 65.53,48.87 | 65.53,48.87 66.9,50.24 66.9,51.31 STMF767IGT6.135 | 64.77,3.45 64.31,3 60.5,3 60.05,3.45 60.05,4.06 SDRAM.46 59.89,4.22 59.89,4.83 59.28,5.44 59.28,10.46 59.44,10.62 | 64.77,3.45 64.77,4.06 SDRAM.52 64.77,3.45 | 59.44,10.62 62.33,13.51 62.33,14.88 SDRAM.6
  Top 0.152: 64.77,3.45 65.23,3 65.99,3 66.29,3.3 66.29,4.06 SDRAM.54 | v56.08,6.5 56.08,4.22 SDRAM.41 | 59.44,10.62 59.28,10.62 v59.13,10.77 | v59.44,27.08 59.44,26.01 STMF767IGT6.71 | v67.06,47.04 67.67,46.43 69.8,46.43 STMF767IGT6.126 | v67.06,33.93 67.97,33.02
  Top 0.254: IC2.1 7.01,47.84 C1.2
  Top 0.406: X3.M1 2.96,24.64 v5.59,24.64 8.62,24.64 X3.M4 | X3.M2 5.21,33.66 | 5.21,33.66 v5.33,33.78 5.33,34.14 7.74,36.55 8.95,37.76 C2.2 | X3.M3 5.21,33.66 | X3.4 10.96,28.41 v11.68,27.69 11.61,27.61 X3.5
  Bottom 0.152: J1.GND3 17.98,76 20.88,76 21.18,76.3 26.67,76.3 26.98,76 J1.GND1 27.13,76 27.89,75.23 27.89,73.71 27.43,73.25 27.43,71.27 J1.GND4 27.28,71.12 27.28,70.66 22.4,65.79 | 27.43,61.21 27.43,58.78 C49.2 | 27.43,61.21 27.28,61.37 J1.GND0 | J1.GND0 27.13,61.52 26.06,61.52 23.77,63.8 23.77,64.26 J1.P$6 23.62,64.41 23.62,64.87 22.71,65.79 22.4,65.79 | 22.4,65.79 17.53,65.79 14.48,62.74 14.48,61.52 J1.GND2 14.48,61.37 14.48,60.3 v14.78,59.99 | 27.43,61.21 29.26,61.21 31.7,63.65 46.94,63.65 CAMERA.1 | 27.43,61.21 J1.GND0 | C45.2 46.18,13.21 46.18,11.99 42.52,8.33 37.03,8.33 LED_DISP.3 | v23.47,24.79 21.64,22.96 v21.59,22.86 21.49,22.96 16.46,22.96 11.73,27.69 v11.68,27.69 | v5.33,33.78 5.33,33.17 4.27,32.11 4.27,25.86 5.49,24.64 v5.59,24.64 | C54.2 76.81,65.48 76.81,65.18 73.61,61.98 C52.2 73.46,61.98 72.85,61.37 72.85,59.99 C55.2 72.69,59.84 72.08,59.23 72.08,58.17 | 72.08,58.17 72.24,58.01 73.76,58.01 75.59,59.84 76.05,59.84 USB_SERIAL.3 | 72.08,58.17 72.08,55.57 75.29,52.38 75.29,48.87 C35.2 75.44,48.72 79.55,44.6 79.55,33.48 C9.2 79.7,33.32 80.01,33.32 81.99,31.34 IO_EXPAND.1 82.14,31.19 82.14,29.97 | IO_EXPAND.8 82.6,22.35 83.36,23.11 83.36,27.84 83.21,27.99 | 83.21,27.99 82.6,28.6 82.14,28.6 IO_EXPAND.3 82.14,28.75 82.14,29.97 | 83.21,27.99 90.22,27.99 WIFI.7 90.37,28.14 90.37,41.86 92.35,43.84 92.35,44.14 ADAFRUIT_GPS.3 | 82.14,29.97 IO_EXPAND.2 | C10.2 46.94,45.21 46.94,43.23 C15.2 46.94,43.08 46.94,35.61 C22.2 46.94,35.46 46.94,33.78 | R13.2 54.25,29.21 54.25,27.69 C16.2 53.19,27.69 | 53.19,27.69 C41.1 49.84,27.69 49.84,28.3 48.46,29.67 C29.2 48.31,29.82 46.94,31.19 46.94,31.34
  Bottom 0.152: 46.94,31.34 46.94,33.78 | 46.94,33.78 C17.2 | 53.19,27.69 v53.19,27.23 | 46.94,31.34 v46.18,31.34 | 63.7,12.6 63.09,13.21 C44.2 62.94,13.36 60.5,15.8 60.5,17.78 C34.2 60.5,17.93 60.5,20.68 63.4,23.57 63.4,27.08 62.79,27.69 C27.2 62.64,27.84 | 63.7,12.6 65.84,12.6 66.45,13.21 C43.2 | 63.4,6.5 62.18,6.5 61.42,5.74 58.83,5.74 C47.2 58.67,5.74 58.67,7.26 58.52,7.42 | 63.4,6.5 64.16,5.74 C48.2 | 58.52,7.42 57.76,8.18 | 57.76,8.18 54.71,11.23 54.71,13.21 C46.2 | 59.74,11.38 60.81,10.31 60.81,9.7 58.52,7.42 | 59.74,11.38 v58.83,12.29 58.52,12.6 58.52,13.21 C42.2 | 57.76,8.18 v56.08,6.5 | 63.7,12.6 63.7,6.81 63.4,6.5 | 59.74,11.38 v59.13,10.77 | 66.45,33.02 66.45,31.5 C26.2 66.29,31.5 62.64,27.84 | 62.64,27.84 61.27,27.84 C28.2 61.11,27.69 60.5,27.08 v59.44,27.08 | C11.2 52.12,48.11 53.49,48.11 C23.2 53.65,48.11 62.18,48.11 C24.2 62.33,48.11 63.4,48.11 C25.2 63.55,48.11 65.99,48.11 v67.06,47.04 67.06,46.28 66.75,45.97 | 66.75,45.97 v66.75,41.55 66.75,40.18 C13.2 66.6,40.03 66.45,39.88 66.45,33.93 | 66.75,45.97 C12.2 | 66.45,33.93 66.45,33.02 | 66.45,33.02 C14.2 | 66.45,33.93 v67.06,33.93
  pour Top: -0.51,83.31 -0.51,-0.25 0,-0.76 107.95,-0.76 108.46,-0.25 108.46,83.82 0,83.82
  pour Bottom: -2.54,84.07 -2.54,-1.02 -1.27,-2.29 109.22,-2.29 110.49,-1.02 110.49,84.07
GPS_EN
  Top 0.152: 70.62,48.43 70.71,48.41 78.79,48.41 87.17,56.79 92.35,56.79 ADAFRUIT_GPS.8
  Top 0.254: 70.62,48.43 69.97,48.43 STMF767IGT6.130
I2C_INT  (via drill 0.35)
  Top 0.152: v74.37,27.53 72.54,29.36 69.95,29.36 STMF767IGT6.92
  Bottom 0.152: v74.37,27.53 75.89,27.53 IO_EXPAND.13
I2C_SCL  (via drill 0.35)
  Top 0.152: v54.71,31.65 51.51,31.65 46.48,26.62 46.48,26.01 STMF767IGT6.45 | v65.38,31.8 65.38,31.19 69.65,26.92 v72.39,26.92
  Bottom 0.152: v54.71,31.65 55.47,31.65 57.76,33.93 63.25,33.93 v65.38,31.8 | v72.39,26.92 72.85,26.92 74.52,28.6 75.89,28.6 IO_EXPAND.14
I2C_SDA  (via drill 0.35)
  Top 0.152: v46.79,24.64 46.79,25.86 STMF767IGT6.46 | v57.91,8.94 v53.8,8.94 | v60.2,10.01 67.06,10.01 69.8,12.75 v70.41,12.75
  Bottom 0.152: v46.79,24.64 55.02,24.64 55.63,24.03 55.63,22.96 53.19,20.52 51.05,20.52 50.29,19.76 50.29,17.17 49.99,16.87 49.99,12.75 v53.8,8.94 | v57.91,8.94 59.13,8.94 v60.2,10.01 | v70.41,12.75 70.41,25.86 74.52,29.97 IO_EXPAND.15
LED1
  Top 0.152: LED3.C 36.42,55.57 42.22,55.57 46.33,51.46 STMF767IGT6.176
LED_EXT  (via drill 0.35)
  Top 0.152: v33.83,5.59 32.77,4.52 32.77,4.06 R27.1 | v50.14,10.77 50.14,11.68 v51.36,12.9 | v51.36,19.91 51.36,25.86 STMF767IGT6.55
  Bottom 0.152: v33.83,5.59 43.43,5.59 44.5,4.52 49.38,4.52 50.29,5.44 50.29,10.62 v50.14,10.77 | v51.36,19.91 v51.36,12.9
N$1  (via drill 0.35)
  Top 0.152: v51.36,29.67 51.05,29.67 48.01,26.62 48.01,26.01 STMF767IGT6.48
  Bottom 0.152: v51.36,29.67 51.66,29.97 54.71,29.97 55.47,29.21 R13.1
N$2  (via drill 0.35)
  Top 0.152: R9.1 24.69,43.54 24.69,43.99 23.16,45.52 23.16,49.78 24.08,50.7 S4.1 24.23,50.85 32.16,50.85 S4.2 32.31,50.85 v34.59,50.85 | v51.51,53.14 51.51,51.46 STMF767IGT6.166
  Bottom 0.152: v51.51,53.14 51.51,53.59 54.25,56.34 54.25,56.95 53.95,57.25 41,57.25 v34.59,50.85
N$4
  Bottom 0.152: C55.1 72.85,58.78 74.07,59.99 74.07,60.6 74.83,61.37 76.05,61.37 USB_SERIAL.6
N$5
  Top 0.152: LED3.A 36.27,54.2 33.83,54.2 32.46,55.57 R22.1
N$6  (via drill 0.35)
  Top 0.152: v64.31,23.88 64.31,25.86 STMF767IGT6.81
  Bottom 0.152: v64.31,23.88 64.31,19.91 62.33,17.93 C34.1
N$8  (via drill 0.35)
  other vias: 31.88,21.97
N$9  (via drill 0.35)
  Top 0.152: v74.07,45.97 69.95,45.97 STMF767IGT6.125
  Bottom 0.152: v74.07,45.97 74.37,45.97 75.29,46.89 C35.1
N$10
  Top 0.152: 48.92,53.14 48.92,51.46 STMF767IGT6.171 | 48.92,53.14 48.92,53.75 R12.1 | 48.92,53.14 50.6,53.14 51.21,53.75 52.58,53.75 R11.1
N$11
  Top 0.152: LED4.A 7.32,17.32 7.32,19 6.25,20.07 R23.1
N$12  (via drill 0.35)
  other vias: 84.96,42.29
N$13
  Top 0.152: 31.39,45.36 31.39,43.54 R24.2 | 31.39,45.36 32.16,46.13 S4.4 | 31.39,45.36 30.63,46.13 24.23,46.13 S4.3
N$14
  Top 0.152: R27.2 34.44,4.06 34.44,8.18 LED_DISP.2
N$24
  Top 0.152: 39.32,22.81 39.78,22.81 39.93,22.66 C38.1 39.32,22.81 | 39.32,22.81 38.71,22.81 | 38.71,22.81 37.49,22.81 C37.1 | 39.32,22.81 39.32,19.76 R10.2 | 38.71,22.81 38.71,27.23 42.37,30.89 44.35,30.89 STMF767IGT6.38
OSC32_IN
  Top 0.152: C30.1 36.88,38.96 36.88,39.88 37.34,40.34 ABS07.P$1 37.34,40.49 35.81,42.01 35.81,45.06 36.27,45.52 37.49,45.52 37.64,45.36 44.35,45.36 STMF767IGT6.9
OSC32_OUT
  Top 0.152: C31.1 36.88,44.45 36.88,43.38 37.34,42.93 ABS07.P$2 37.49,42.93 37.8,42.93 39.62,44.75 44.35,44.75 STMF767IGT6.10
OSC_IN
  Top 0.152: 39.47,35.31 39.47,33.78 ABM3.1 | 39.47,35.31 39.47,36.22 C32.1 | 39.47,35.31 44.35,35.31 STMF767IGT6.29
OSC_OUT
  Top 0.152: C33.1 34.9,36.83 34.9,34.09 35.2,33.78 ABM3.2 35.36,33.78 35.97,34.39 37.19,34.39 37.49,34.09 37.49,32.41 38.71,31.19 39.62,31.19 43.28,34.85 44.35,34.85 STMF767IGT6.30
RESET  (via drill 0.35)
  Top 0.152: S2.1 17.53,29.21 24.38,22.35 24.38,20.07 R8.2 24.54,20.07 24.69,19.91 31.39,19.91 31.7,20.22 34.59,20.22 34.75,20.37 34.75,21.89 v30.79,25.86 27.43,29.21 25.45,29.21 S2.2 | v47.55,54.81 44.2,58.17 C36.1 | v47.55,36.83 45.11,34.39 44.5,34.39 STMF767IGT6.31
  Bottom 0.152: v47.55,36.83 47.55,45.97 | 47.55,45.97 v47.55,54.81 | v30.79,25.86 31.24,25.86 41.3,35.92 41.3,36.83 46.18,41.71 46.18,45.67 46.48,45.97 47.55,45.97
SDIO_CMD  (via drill 0.35)
  Top 0.152: v61.87,58.01 62.33,57.56 62.33,51.46 STMF767IGT6.144 | v55.47,58.01 v59.89,58.01 | v29.87,58.01 19.96,58.01 v18.29,59.69
  Bottom 0.152: R17.2 18.29,58.78 v18.29,59.69 18.29,62.74 17.37,63.65 17.37,65.18 17.68,65.48 19.66,65.48 20.27,64.87 20.27,64.41 J1.P$3 | v59.89,58.01 v61.87,58.01 | v29.87,58.01 v55.47,58.01
SDIO_D0/DCMI_D2  (via drill 0.35)
  Top 0.152: v71.32,42.62 70.56,41.86 69.95,41.86 STMF767IGT6.117 | v58.67,65.33 57.15,63.8 CAMERA.9
  Bottom 0.152: 28.35,69.75 28.35,76.3 27.89,76.76 17.07,76.76 10.36,70.05 10.36,62.74 14.02,59.08 14.02,58.78 R16.2 | 28.35,69.75 24.69,66.09 24.69,64.41 J1.P$7 | v71.32,42.62 71.78,43.08 71.78,61.21 68.43,64.57 68.43,66.7 67.51,67.62 59.59,67.62 58.67,66.7 | v58.67,65.33 58.67,66.7 | 28.35,69.75 45.11,69.75 46.94,67.92 57.45,67.92 58.67,66.7
SDIO_D1/DCMI_D3  (via drill 0.35)
  Top 0.152: v15.24,64.41 19.96,64.41 21.34,65.79 v25.3,65.79 44.5,65.79 v47.24,68.53 | v68.58,43.08 69.19,42.47 69.8,42.47 STMF767IGT6.118 | CAMERA.12 v57.45,68.53
  Bottom 0.152: v15.24,64.41 11.28,64.41 R15.2 | v25.3,65.79 25.3,65.33 25.76,64.87 25.76,64.41 J1.P$8 | v68.58,43.08 68.58,52.22 65.84,54.97 65.84,66.7 65.23,67.31 60.66,67.31 59.74,66.4 CAMERA.12 | v57.45,68.53 v47.24,68.53
SDIO_D2  (via drill 0.35)
  Top 0.152: v28.65,64.57 20.57,64.57 v19.05,63.04 | v55.93,67.01 55.93,67.92 57.15,69.14 60.81,69.14 63.25,66.7 63.25,63.8 63.86,63.2 63.86,55.27 64.92,54.2 64.92,51.46 STMF767IGT6.139
  Bottom 0.152: v28.65,64.57 30.18,64.57 R19.2 30.33,64.72 30.48,64.87 54.71,64.87 55.93,66.09 v55.93,67.01 | v19.05,63.04 18.14,63.96 18.14,64.26 J1.P$1
SDIO_D3/DCMI_D4  (via drill 0.35)
  Top 0.152: v64.31,53.29 64.31,51.46 STMF767IGT6.140 | v60.96,56.64 60.96,57.56 60.5,58.01 60.5,62.89 59.74,63.65 CAMERA.11 58.37,62.43 54.41,62.43 53.19,63.65 53.19,66.7 52.58,67.31 46.48,67.31 39.32,60.15 v22.71,60.15
  Bottom 0.152: R18.2 22.71,58.78 v22.71,60.15 22.71,60.45 19.36,63.8 19.36,64.26 J1.P$2 | v60.96,56.64 v64.31,53.29
SDIO_SCK  (via drill 0.35)
  Top 0.152: v61.27,50.09 63.25,50.09 63.86,50.7 63.86,51.31 STMF767IGT6.141 | v56.69,54.66 56.69,54.97 v52.73,58.93
  Bottom 0.152: v56.69,54.66 v61.27,50.09 | v52.73,58.93 29.72,58.93 29.26,59.38 28.35,59.38 28.19,59.23 28.19,58.17 27.89,57.86 27.13,57.86 22.55,62.43 22.55,64.26 J1.P$5
SPI2_CS
  Top 0.152: STMF767IGT6.99 69.95,32.87 71.32,32.87 81.08,23.11 90.22,23.11 WIFI.5
SPI2_MISO
  Top 0.152: STMF767IGT6.94 69.95,30.28 73,30.28 85.34,17.93 90.22,17.93 WIFI.3
SPI2_MOSI
  Top 0.152: STMF767IGT6.95 69.95,30.89 72.85,30.89 83.21,20.52 90.22,20.52 WIFI.4
SPI2_RESET
  Top 0.152: STMF767IGT6.100 69.95,33.32 71.32,33.32 79.1,25.55 90.22,25.55 WIFI.6
SPI2_SCK
  Top 0.152: STMF767IGT6.93 69.95,29.82 73,29.82 87.33,15.49 90.22,15.49 WIFI.2
UART4_RX
  Top 0.152: STMF767IGT6.122 69.95,44.3 84.43,44.3 84.73,43.99 89.61,43.99 92.35,46.74 ADAFRUIT_GPS.4
UART4_TX
  Top 0.152: STMF767IGT6.123 69.95,44.91 75.74,44.91 81.38,50.55 91.14,50.55 92.35,49.33 ADAFRUIT_GPS.5
USART1_RX  (via drill 0.35)
  Top 0.152: v78.79,52.07 71.17,52.07 66.45,47.35 66.45,46.74 69.34,43.84 69.8,43.84 STMF767IGT6.121
  Bottom 0.152: USB_SERIAL.25 78.49,54.66 79.86,53.29 R20.1 79.86,53.14 v78.79,52.07
USART1_TX  (via drill 0.35)
  Top 0.152: v78.03,52.68 71.32,52.68 66.14,47.5 66.14,46.43 69.19,43.38 69.8,43.38 STMF767IGT6.120
  Bottom 0.152: USB_SERIAL.26 78.03,57.86 v78.03,52.68 78.03,51.92 80.62,49.33 81.99,49.33 84.58,51.92 84.58,58.78 R1.1
VDD3.3V  (via drill 0.35)
  Top 0.152: v47.55,12.29 45.72,14.12 45.72,14.88 SDRAM.27 45.57,15.04 42.52,15.04 v41.15,16.41 | ACCELEROMETER.15 16.46,12.6 16.92,12.6 ACCELEROMETER.14 17.07,12.6 17.07,12.9 17.37,13.21 18.14,13.21 v18.44,12.9 | 17.37,14.73 17.37,19.61 17.83,20.07 C18.1 | 19.51,12.6 19.36,12.75 19.36,13.36 17.98,14.73 17.37,14.73 | 19.51,12.6 21.18,10.92 21.18,9.86 21.34,9.7 22.4,9.7 23.01,10.31 23.01,20.07 R8.1 | 17.37,14.73 C51.1 | 19.51,12.6 v19.66,12.6 | v29.41,14.73 31.24,16.56 R2.1 | v37.64,18.24 37.64,19.61 R10.1 | 48.16,54.2 v48.16,52.53 48.16,52.22 48.31,52.07 48.31,51.46 STMF767IGT6.172 | 48.16,54.2 48.16,54.36 48.46,54.66 49.38,54.66 50.14,53.9 R12.2 | 35.2,55.73 33.68,55.73 R22.2 | 35.2,55.73 35.81,56.34 43.43,56.34 | 43.43,56.34 45.11,56.34 47.24,54.2 48.16,54.2 | 43.43,56.34 43.43,62.74 CAMERA.2 | 29.26,42.62 30.02,43.38 R24.1 30.18,43.38 30.94,42.62 31.7,42.62 37.03,47.95 37.03,54.66 36.88,54.81 35.97,54.81 35.66,55.12 35.66,55.27 35.2,55.73 | 29.26,42.62 28.8,42.16 28.8,39.42 v28.7,39.37 28.65,39.27 26.06,36.68 17.53,36.68 16.15,35.31 16.15,29.06 7.62,20.52 7.62,20.07 R23.2 | 29.26,42.62 27.43,44.45 25.76,44.45 25.6,44.3 25.6,42.62 25.76,42.47 25.76,38.96 S3.2 | 84.89,46.89 86.11,48.11 93.73,48.11 94.64,47.19 94.64,43.84 ADAFRUIT_GPS.2 | 84.89,46.89 84.43,46.43 84.43,45.52 85.19,44.75 C56.1 | v81.69,49.94 84.73,46.89 84.89,46.89 | 86.41,12.75 90.22,12.75 WIFI.1 | 86.41,12.75 85.8,12.75 C19.1 | 86.41,12.75 86.41,14.43 73.76,27.08 73.76,27.38 72.39,28.75 69.95,28.75 STMF767IGT6.91 | 55.17,50.39 55.02,50.55 55.02,51.31 STMF767IGT6.159 | 55.17,50.39 59.59,50.39 59.89,50.7 59.89,51.31 STMF767IGT6.149
  Top 0.152: v65.23,49.48 66.29,50.55 66.29,51.31 STMF767IGT6.136 | v55.17,49.48 55.17,50.39 | 75.13,34.85 69.95,34.85 STMF767IGT6.103 69.8,34.85 67.97,34.85 v67.82,34.7 | 75.13,34.85 v76.96,34.85 | v67.97,41.25 68.89,40.34 69.8,40.34 STMF767IGT6.114 | v67.97,47.04 68.12,46.89 69.8,46.89 STMF767IGT6.127 | 46.18,38.96 45.57,38.35 44.5,38.35 STMF767IGT6.23 | 46.18,38.96 46.18,41.25 45.26,42.16 | 45.26,42.16 45.11,42.32 44.5,42.32 STMF767IGT6.15 | 45.26,42.16 45.26,46.58 44.96,46.89 44.5,46.89 STMF767IGT6.6 | v48.16,38.96 46.18,38.96 | 51.66,27.84 53.65,27.84 54.86,26.62 54.86,26.01 STMF767IGT6.62 | 51.66,27.84 49.68,27.84 48.46,26.62 48.46,26.01 STMF767IGT6.49 | v43.13,31.8 44.35,31.8 STMF767IGT6.36 | v51.66,27.08 51.66,27.84 | v55.78,11.68 56.84,11.68 57.15,11.99 | 57.15,11.99 57.15,13.21 56.08,14.28 56.08,14.88 SDRAM.14 55.93,15.04 55.93,15.65 v55.17,16.41 | 59.89,20.98 59.89,15.04 SDRAM.9 59.89,14.88 59.74,14.73 v59.74,12.29 59.13,11.68 58.52,11.68 58.22,11.99 57.15,11.99 | 59.89,20.98 STMF767IGT6.72 59.89,26.01 59.89,26.47 60.05,26.62 60.05,27.38 59.74,27.69 v59.74,27.99 | 59.89,20.98 65.23,20.98 v66.14,21.89 67.97,23.72 67.97,24.33 67.67,24.64 65.53,24.64 64.92,25.25 64.92,25.86 STMF767IGT6.82 | 66.29,14.28 65.84,13.82 65.38,13.82 64.92,14.28 64.92,14.88 SDRAM.3 | 66.29,14.28 66.29,14.88 SDRAM.1 66.29,14.28 | v67.21,14.28 66.29,14.28 | v57.45,6.81 57.45,4.22 SDRAM.43 | v62.03,5.44 62.33,5.13 62.33,4.22 SDRAM.49 | v75.13,32.11 75.13,34.85
  Top 0.254: 85.33,44.58 C56.1 | IC2.2 7.29,43.69 v10.03,43.69 | C1.1 10.35,44 v10.03,43.69 | v10.03,43.69 10.03,40.64 15.04,40.64 S3.1 S3.2
  Bottom 0.152: v47.55,12.29 47.55,13.21 C45.1 | v18.44,12.9 19.36,12.9 v19.66,12.6 21.79,14.73 | 21.79,14.73 v29.41,14.73 33.68,14.73 37.19,18.24 v37.64,18.24 37.95,18.24 39.78,16.41 v41.15,16.41 | R19.1 30.18,63.5 28.8,63.5 28.04,64.26 28.04,64.87 29.41,66.24 46.94,66.24 CAMERA.2 | R18.1 23.93,58.62 23.16,57.86 20.57,57.86 19.81,58.62 R17.1 19.66,58.62 18.9,57.86 17.98,57.86 17.22,58.62 15.39,58.62 R16.1 15.24,58.78 14.63,59.38 14.48,59.38 11.28,62.59 11.28,63.04 R15.1 | 28.04,57.56 28.8,58.32 28.8,58.62 C49.1 | 28.04,57.56 25.15,57.56 24.08,58.62 R18.1 | J1.P$4 21.49,64.26 21.49,62.28 23.93,59.84 23.93,58.78 R18.1 | 28.04,57.56 28.04,40.03 v28.7,39.37 | 21.79,14.73 21.79,15.19 10.06,26.92 10.06,43.69 v10.03,43.69 | R1.2 84.58,60.76 80.01,56.18 80.01,55.12 R20.2 80.01,54.97 81.69,53.29 v81.69,49.94 | ADAFRUIT_GPS.2 92.35,41.55 92.35,41.25 90.68,39.57 90.68,29.97 92.05,28.6 92.05,14.58 WIFI.1 90.22,12.75 75.74,12.75 71.32,8.33 67.82,8.33 | C11.1 52.12,49.48 53.49,49.48 C23.1 53.65,49.48 v55.17,49.48 62.18,49.48 C24.1 62.33,49.48 63.4,49.48 C25.1 63.55,49.48 v65.23,49.48 65.53,49.48 v67.97,47.04 C12.1 | v76.96,34.85 78.33,33.48 C9.1 | C14.1 67.82,33.02 v67.82,34.7 67.82,40.03 C13.1 67.97,40.18 v67.97,41.25 C12.1 | C12.1 | C10.1 48.16,43.23 C15.1 48.16,43.08 v48.16,38.96 48.16,35.61 C22.1 48.16,35.46 C17.1 | 49.99,30.28 49.99,31.95 C17.1 | 49.99,30.28 49.99,29.82 C29.1 | C17.1 | 51.66,26.62 54.41,26.62 55.47,27.69 C16.1 56.24,27.69 57.3,28.75 | 51.66,26.62 49.84,26.62 48.77,27.69 C41.2 48.62,27.69 44.5,31.8 v43.13,31.8 | 57.3,28.75 61.87,33.32 63.4,33.32 63.7,33.02 63.7,32.41 62.79,31.5 62.79,29.21 C27.1 62.64,29.21 61.27,29.21 C28.1 61.11,29.06 60.81,29.06 v59.74,27.99
  Bottom 0.152: 51.66,26.62 v51.66,27.08 | 49.99,30.28 55.78,30.28 57.3,28.75 | v55.78,11.68 55.78,13.21 C46.1 | v55.17,16.41 55.47,16.1 56.54,16.1 57.3,16.87 R14.1 | v59.74,12.29 59.74,13.21 C42.1 | IO_EXPAND.16 75.89,31.34 v75.13,32.11 74.98,32.26 71.02,32.26 70.26,31.5 C26.1 67.67,31.5 67.67,25.71 66.45,24.49 66.45,21.89 | 67.06,14.12 66.14,14.12 65.38,13.36 64.31,13.36 C44.1 | 67.06,14.12 67.82,13.36 C43.1 67.82,13.21 67.82,8.33 | 67.06,14.12 v67.21,14.28 67.97,15.04 67.97,19 66.45,20.52 66.45,21.89 | 62.03,4.98 62.33,4.98 62.94,5.59 C48.1 63.09,5.59 63.7,4.98 64.77,4.98 67.82,8.03 67.82,8.33 | 62.03,4.98 58.06,4.98 57.45,5.59 C47.1 57.45,5.74 v57.45,6.81 | 62.03,4.98 v62.03,5.44 | 66.45,21.89 v66.14,21.89 | C10.1 v48.16,52.53 | C10.1
VDDA  (via drill 0.35)
  Top 0.152: 33.07,19.3 33.53,19.3 C40.1 33.07,19.3 | 33.07,19.3 30.94,19.3 C39.1 | 33.07,19.3 33.07,17.93 | 33.07,17.93 33.07,16.71 R2.2 | v39.93,27.53 42.67,30.28 44.35,30.28 STMF767IGT6.39 | 33.07,17.93 v34.14,17.93
  Bottom 0.152: v39.93,27.53 39.93,23.72 v34.14,17.93
WK_UP
  Top 0.152: STMF767IGT6.40 44.5,29.82 45.11,29.82 45.26,29.67 45.26,27.23 41.6,23.57 41.6,19.61 38.71,16.71 37.64,16.71 35.66,18.69 35.66,22.05 25.91,31.8 25.91,34.24 S3.4 25.76,34.39 17.98,34.39 S3.3

## Text on the board
tNames: TEAM 18 | DASH CAM V1